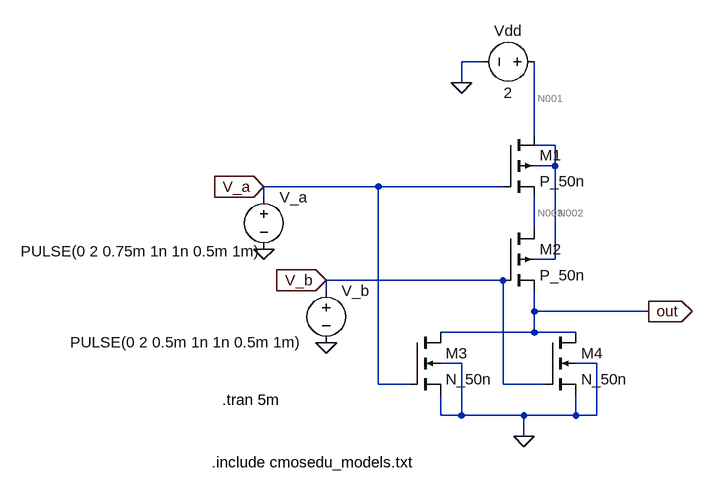
[diagram p0: schematic Draft1.asc]
Draft1.asc, the LTspice schematic file:
Version 4
SHEET 1 880 692
WIRE 224 -32 192 -32
WIRE 192 0 192 -32
WIRE 304 80 304 -32
WIRE 336 96 304 96
WIRE 336 128 336 96
WIRE 336 128 304 128
WIRE 64 160 -112 160
WIRE 256 160 64 160
WIRE -112 176 -112 160
WIRE 304 224 304 176
WIRE 336 272 336 128
WIRE 336 272 304 272
WIRE 256 304 -16 304
WIRE -16 320 -16 304
WIRE 304 352 304 320
WIRE 480 352 304 352
WIRE 304 384 304 352
WIRE 304 384 160 384
WIRE 368 384 304 384
WIRE 192 432 160 432
WIRE 400 432 368 432
WIRE 64 464 64 160
WIRE 112 464 64 464
WIRE 256 464 256 304
WIRE 320 464 256 464
WIRE 160 512 160 480
WIRE 192 512 192 432
WIRE 192 512 160 512
WIRE 288 512 192 512
WIRE 368 512 368 480
WIRE 368 512 288 512
WIRE 400 512 400 432
WIRE 400 512 368 512
WIRE 288 544 288 512
FLAG 288 544 0
FLAG -112 256 0
FLAG -16 400 0
FLAG 192 0 0
FLAG 480 352 out
IOPIN 480 352 Out
FLAG -112 160 V_a
IOPIN -112 160 In
FLAG -16 304 V_b
IOPIN -16 304 In
SYMBOL pmos4 256 80 R0
SYMATTR InstName M1
SYMATTR Value P_50n
SYMATTR Value2 l=50n w=1u
SYMBOL pmos4 256 224 R0
SYMATTR InstName M2
SYMATTR Value P_50n
SYMATTR Value2 l=50n w=1u
SYMBOL nmos4 112 384 R0
SYMATTR InstName M3
SYMATTR Value N_50n
SYMATTR Value2 l=50n w=0.5u
SYMBOL nmos4 320 384 R0
SYMATTR InstName M4
SYMATTR Value N_50n
SYMATTR Value2 l=50n w=0.5u
SYMBOL voltage 320 -32 M270
WINDOW 0 32 56 VTop 2
WINDOW 3 -32 56 VBottom 2
WINDOW 123 0 0 Left 0
WINDOW 39 0 0 Left 0
SYMATTR InstName Vdd
SYMATTR Value 2
SYMBOL voltage -112 160 R0
WINDOW 3 -374 99 Left 2
WINDOW 123 0 0 Left 0
WINDOW 39 0 0 Left 0
SYMATTR Value PULSE(0 2 0.75m 1n 1n 0.5m 1m)
SYMATTR InstName V_a
SYMBOL voltage -16 304 R0
WINDOW 3 -394 95 Left 2
WINDOW 123 0 0 Left 0
WINDOW 39 0 0 Left 0
SYMATTR Value PULSE(0 2 0.5m 1n 1n 0.5m 1m)
SYMATTR InstName V_b
TEXT -192 584 Left 2 !.include cmosedu_models.txt
TEXT -176 488 Left 2 !.tran 5m

The netlist it stands for:
* Draft1.asc
M1 N001 V_a N003 N002 P_50n l=50n w=1u
M2 N003 V_b out N002 P_50n l=50n w=1u
M3 out V_a 0 0 N_50n l=50n w=0.5u
M4 out V_b 0 0 N_50n l=50n w=0.5u
Vdd N001 0 2
V_a V_a 0 PULSE(0 2 0.75m 1n 1n 0.5m 1m)
V_b V_b 0 PULSE(0 2 0.5m 1n 1n 0.5m 1m)
.model NMOS NMOS
.model PMOS PMOS
.lib standard.mos
.include cmosedu_models.txt
.tran 5m
.backanno
.end

* Results of the author's LTspice run, read from the files saved beside the schematic
* Operating Point, zero values left out:
*   V(n001) = 2 V
*   V(n003) = 1.97 V
*   V(n002) = 1.401 V
*   V(out) = 1.942 V
*   Id(M4) = 12.04 µA
*   Ig(M4) = -35.4 nA
*   Ib(M4) = -12 µA
*   Is(M4) = -6.126 nA
*   Id(M3) = 12.04 µA
*   Ig(M3) = -35.4 nA
*   Ib(M3) = -12 µA
*   Is(M3) = -6.126 nA
*   Id(M2) = 25.06 µA
*   Ig(M2) = -1.445 µA
*   Ib(M2) = 472.3 nA
*   Is(M2) = -24.08 µA
*   Id(M1) = 27.2 µA
*   Ig(M1) = -1.676 µA
*   Ib(M1) = -472.9 nA
*   Is(M1) = -25.06 µA
*   I(V_b) = 1.481 µA
*   I(V_a) = 1.712 µA
*   I(Vdd) = -27.2 µA
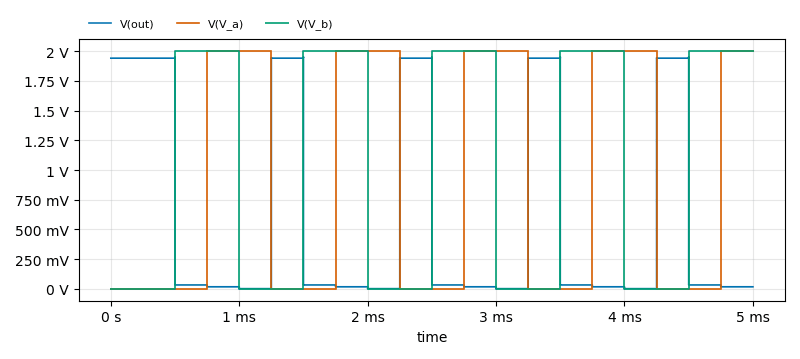
[diagram p1: Transient Analysis of Draft1.asc, plotted from the saved traces]
* Transient Analysis, 1 run:
*   V(out): min 569 µV, max 1.953 V, average 595.2 mV, rms 1.064 V, last 17.3 mV
*   V(V_a): min 0 V, max 2 V, average 900 mV, rms 1.342 V, last 2 V
*   V(V_b): min 0 V, max 2 V, average 1 V, rms 1.414 V, last 2 V